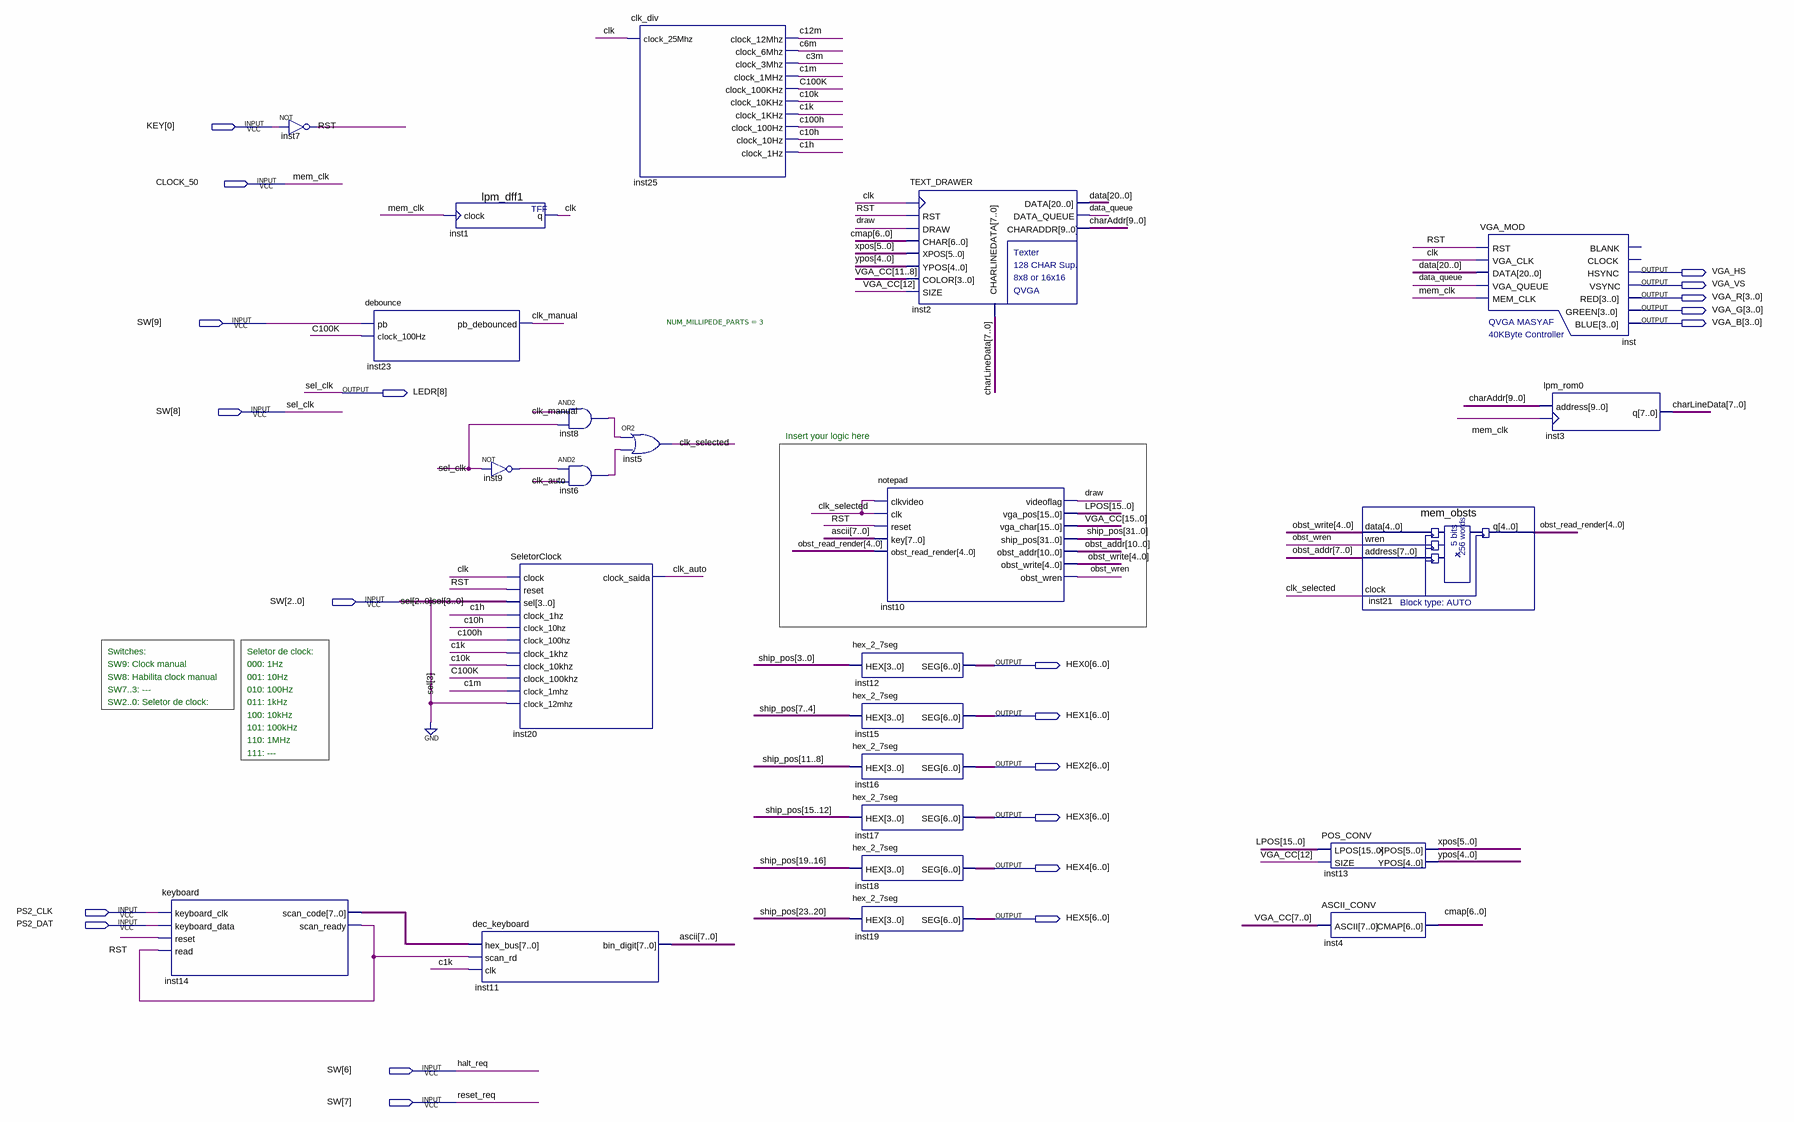
[diagram p0: schematic sheet]
// Quartus schematic AP9.bdf as structural Verilog: 24 symbols, 21 pins
module AP9 (
  input  [0:0] KEY,
  input  CLOCK_50,
  input  [9:0] SW,
  input  PS2_CLK,
  input  PS2_DAT,
  output VGA_HS,
  output VGA_VS,
  output [3:0] VGA_R,
  output [3:0] VGA_G,
  output [3:0] VGA_B,
  output [8:8] LEDR,
  output [6:0] HEX0,
  output [6:0] HEX1,
  output [6:0] HEX2,
  output [6:0] HEX3,
  output [6:0] HEX4,
  output [6:0] HEX5
);

  wire c1h, c1k, c1m, c3m, c6m, c10h, c10k, c12m, c100h, C100K, clk, clk_auto, clk_manual, clk_selected,
       data_queue, draw, inst6_out, inst8_out, inst9_out, inst14_scan_ready, obst_wren, RST;
  wire [4:0] obst_read_render, obst_write, ypos;
  wire [5:0] xpos;
  wire [6:0] cmap;
  wire [7:0] ascii, charLineData, inst14_scan_code;
  wire [9:0] charAddr;
  wire [10:0] obst_addr;
  wire [15:0] LPOS, VGA_CC;
  wire [20:0] data;
  wire [31:0] ship_pos;

  keyboard inst14 (
    .keyboard_clk(PS2_CLK), .keyboard_data(PS2_DAT), .reset(RST), .read(inst14_scan_ready),
    .scan_code(inst14_scan_code), .scan_ready(inst14_scan_ready));
  not inst7 (RST, KEY[0]);
  debounce inst23 (.pb(SW[9]), .clock_100Hz(C100K), .pb_debounced(clk_manual));
  lpm_dff1 inst1 (.clock(CLOCK_50), .q(clk));
  not inst9 (inst9_out, SW[8]);
  dec_keyboard inst11 (.hex_bus(inst14_scan_code), .scan_rd(inst14_scan_ready), .clk(c1k), .bin_digit(ascii));
  SeletorClock inst20 (
    .clock(clk), .reset(RST), .sel({1'b0, SW[2:0]}), .clock_1hz(c1h), .clock_10hz(c10h), .clock_100hz(c100h),
    .clock_1khz(c1k), .clock_10khz(c10k), .clock_100khz(C100K), .clock_1mhz(c1m), .clock_12mhz(1'b0),
    .clock_saida(clk_auto));
  and inst8 (inst8_out, clk_manual, SW[8]);
  and inst6 (inst6_out, inst9_out, clk_auto);
  clk_div inst25 (
    .clock_25Mhz(clk), .clock_12Mhz(c12m), .clock_6Mhz(c6m), .clock_3Mhz(c3m), .clock_1MHz(c1m),
    .clock_100KHz(C100K), .clock_10KHz(c10k), .clock_1KHz(c1k), .clock_100Hz(c100h), .clock_10Hz(c10h),
    .clock_1Hz(c1h));
  or inst5 (clk_selected, inst8_out, inst6_out);
  notepad #(.NUM_MILLIPEDE_PARTS(3)) inst10 (
    .clkvideo(clk_selected), .clk(clk_selected), .reset(RST), .key(ascii),
    .obst_read_render(obst_read_render), .videoflag(draw), .vga_pos(LPOS), .vga_char(VGA_CC),
    .ship_pos(ship_pos), .obst_addr(obst_addr), .obst_write(obst_write), .obst_wren(obst_wren));
  hex_2_7seg inst12 (.HEX(ship_pos[3:0]), .SEG(HEX0));
  hex_2_7seg inst15 (.HEX(ship_pos[7:4]), .SEG(HEX1));
  hex_2_7seg inst16 (.HEX(ship_pos[11:8]), .SEG(HEX2));
  hex_2_7seg inst17 (.HEX(ship_pos[15:12]), .SEG(HEX3));
  hex_2_7seg inst18 (.HEX(ship_pos[19:16]), .SEG(HEX4));
  hex_2_7seg inst19 (.HEX(ship_pos[23:20]), .SEG(HEX5));
  TEXT_DRAWER inst2 (
    .RST(RST), .DRAW(draw), .XPOS(xpos), .YPOS(ypos), .COLOR(VGA_CC[11:8]), .SIZE(VGA_CC[12]),
    .CHARLINEDATA(charLineData), .CLK(clk), .CHAR(cmap), .DATA(data), .DATA_QUEUE(data_queue),
    .CHARADDR(charAddr));
  POS_CONV inst13 (.LPOS(LPOS), .SIZE(VGA_CC[12]), .XPOS(xpos), .YPOS(ypos));
  ASCII_CONV inst4 (.ASCII(VGA_CC[7:0]), .CMAP(cmap));
  mem_obsts inst21 (
    .data(obst_write), .wren(obst_wren), .address(obst_addr[7:0]), .clock(clk_selected), .q(obst_read_render));
  VGA_MOD inst (
    .RST(RST), .VGA_CLK(clk), .DATA(data), .VGA_QUEUE(data_queue), .MEM_CLK(CLOCK_50), .HSYNC(VGA_HS),
    .VSYNC(VGA_VS), .RED(VGA_R), .GREEN(VGA_G), .BLUE(VGA_B));  // open: BLANK, CLOCK
  lpm_rom0 inst3 (.clock(CLOCK_50), .address(charAddr), .q(charLineData));

  assign LEDR[8] = SW[8];

  // Other names for the same wires on the sheet: halt_req = SW[6]; mem_clk = CLOCK_50; reset_req = SW[7];
  //   sel[2:0] = SW[2:0]; sel_clk = SW[8]

  // Notes on the sheet:
  //   Insert your logic here
  //   Switches:
  //   Seletor de clock:
  //   SW9: Clock manual
  //   000: 1Hz
  //   SW8: Habilita clock manual
  //   001: 10Hz
  //   SW7..3: ---
  //   010: 100Hz
  //   SW2..0: Seletor de clock:
  //   011: 1kHz
  //   100: 10kHz
  //   101: 100kHz
  //   110: 1MHz
  //   111: ---
endmodule
